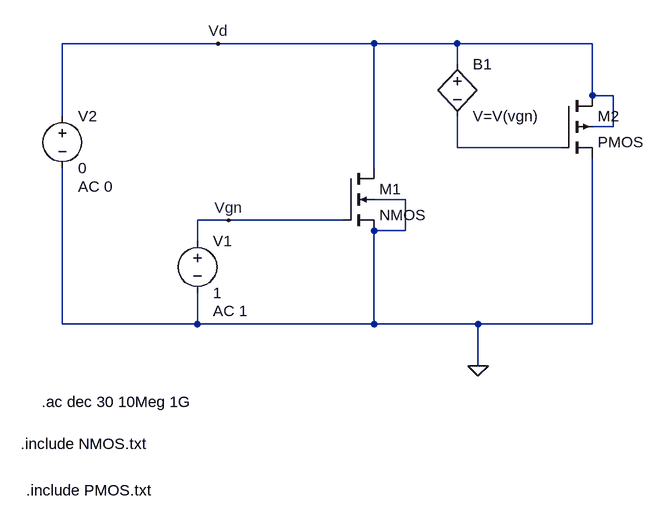
[diagram p0: schematic CMOS_Char_ac.asc]
CMOS_Char_ac.asc, the LTspice schematic file:
Version 4
SHEET 1 880 680
WIRE -80 -64 -320 -64
WIRE 160 -64 -80 -64
WIRE 288 -64 160 -64
WIRE 496 -64 288 -64
WIRE 288 -32 288 -64
WIRE 496 16 496 -64
WIRE 528 16 496 16
WIRE -320 48 -320 -64
WIRE 528 64 528 16
WIRE 528 64 496 64
WIRE 288 96 288 48
WIRE 448 96 288 96
WIRE 160 128 160 -64
WIRE 208 176 160 176
WIRE -64 208 -112 208
WIRE 112 208 -64 208
WIRE 208 224 208 176
WIRE 208 224 160 224
WIRE -112 240 -112 208
WIRE -320 368 -320 128
WIRE -112 368 -112 320
WIRE -112 368 -320 368
WIRE 160 368 160 224
WIRE 160 368 -112 368
WIRE 320 368 160 368
WIRE 496 368 496 112
WIRE 496 368 320 368
WIRE 320 432 320 368
FLAG -64 208 Vgn
FLAG -80 -64 Vd
FLAG 320 432 0
SYMBOL voltage -112 224 R0
WINDOW 123 24 124 Left 2
WINDOW 39 0 0 Left 0
SYMATTR Value2 AC 1
SYMATTR InstName V1
SYMATTR Value 1
SYMBOL voltage -320 32 R0
WINDOW 123 24 124 Left 2
WINDOW 39 0 0 Left 0
SYMATTR Value2 AC 0
SYMATTR InstName V2
SYMATTR Value 0
SYMBOL nmos4 112 128 R0
SYMATTR InstName M1
SYMATTR Value2 w=100u
SYMBOL pmos4 448 16 R0
SYMATTR InstName M2
SYMATTR Value2 w=100u
SYMBOL bv 288 -48 R0
SYMATTR InstName B1
SYMATTR Value V=V(vgn)
TEXT -384 552 Left 2 !.include NMOS.txt
TEXT -352 488 Left 2 !.ac dec 30 10Meg 1G
TEXT -376 624 Left 2 !.include PMOS.txt

The netlist it stands for:
* CMOS_Char_ac.asc
V1 Vgn 0 1 AC 1
V2 Vd 0 0 AC 0
M1 Vd Vgn 0 0 NMOS w=100u
M2 Vd N001 0 Vd PMOS w=100u
B1 Vd N001 V=V(vgn)
.model NMOS NMOS
.model PMOS PMOS
.lib standard.mos
.include NMOS.txt
.ac dec 30 10Meg 1G
.include PMOS.txt
.backanno
.end